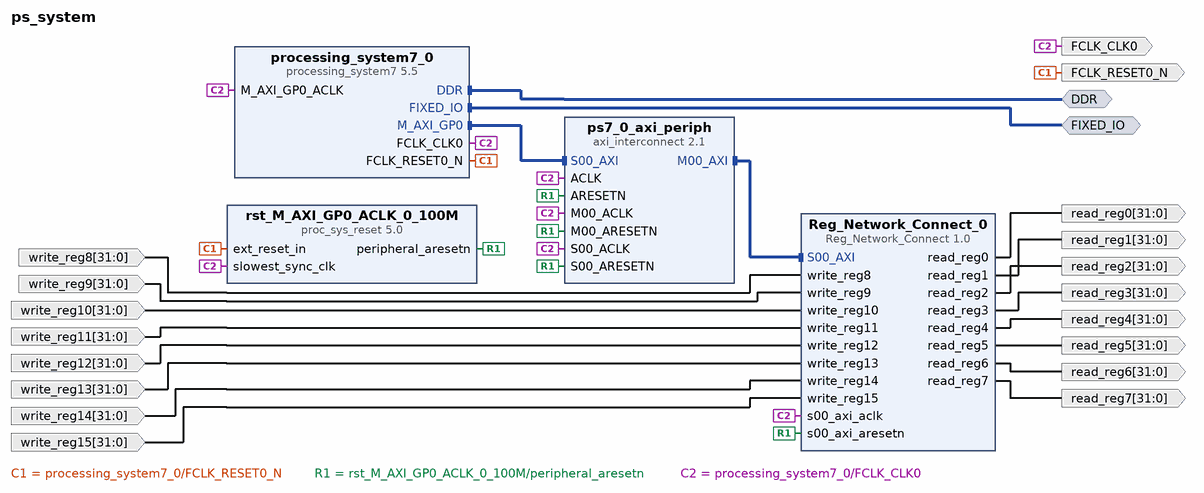
[diagram p0: block diagram of the top level]
# Vivado block design ps_system, xc7z010clg400-1, Vivado 2020.1
create_bd_design ps_system

create_bd_intf_port -mode Master -vlnv xilinx.com:interface:ddrx_rtl:1.0 DDR
create_bd_intf_port -mode Master -vlnv xilinx.com:display_processing_system7:fixedio_rtl:1.0 FIXED_IO
create_bd_port -dir O -from 31 -to 0 read_reg0
create_bd_port -dir O -from 31 -to 0 read_reg1
create_bd_port -dir O -from 31 -to 0 read_reg2
create_bd_port -dir O -from 31 -to 0 read_reg3
create_bd_port -dir O -from 31 -to 0 read_reg6
create_bd_port -dir O -from 31 -to 0 read_reg4
create_bd_port -dir O -from 31 -to 0 read_reg5
create_bd_port -dir O -from 31 -to 0 read_reg7
create_bd_port -dir I -from 31 -to 0 write_reg14
create_bd_port -dir I -from 31 -to 0 write_reg12
create_bd_port -dir I -from 31 -to 0 write_reg8
create_bd_port -dir I -from 31 -to 0 write_reg9
create_bd_port -dir I -from 31 -to 0 write_reg13
create_bd_port -dir I -from 31 -to 0 write_reg10
create_bd_port -dir I -from 31 -to 0 write_reg11
create_bd_port -dir I -from 31 -to 0 write_reg15
create_bd_port -dir O -type rst FCLK_RESET0_N
create_bd_port -dir O -type clk FCLK_CLK0
set_property -dict {CONFIG.ASSOCIATED_RESET FCLK_RESET0_N_0} [get_bd_ports FCLK_CLK0]

create_bd_cell -type ip -vlnv xilinx.com:ip:processing_system7:5.5 processing_system7_0
set_property -dict {CONFIG.PCW_FPGA0_PERIPHERAL_FREQMHZ 125} [get_bd_cells processing_system7_0]
# 30 more settings of processing_system7_0 are not shown: defaults, MIO pin electricals, DDR timing, and values the tool derives
create_bd_cell -type ip -vlnv xilinx.com:ip:axi_interconnect:2.1 ps7_0_axi_periph
set_property -dict {CONFIG.NUM_MI 1} [get_bd_cells ps7_0_axi_periph]
create_bd_cell -type ip -vlnv xilinx.com:ip:proc_sys_reset:5.0 rst_M_AXI_GP0_ACLK_0_100M
create_bd_cell -type ip -vlnv xilinx.com:user:Reg_Network_Connect:1.0 Reg_Network_Connect_0

# ---- connections ----

connect_bd_intf_net [get_bd_intf_ports DDR] [get_bd_intf_pins processing_system7_0/DDR]
connect_bd_intf_net [get_bd_intf_pins processing_system7_0/M_AXI_GP0] [get_bd_intf_pins ps7_0_axi_periph/S00_AXI]
connect_bd_intf_net [get_bd_intf_ports FIXED_IO] [get_bd_intf_pins processing_system7_0/FIXED_IO]
connect_bd_intf_net [get_bd_intf_pins ps7_0_axi_periph/M00_AXI] [get_bd_intf_pins Reg_Network_Connect_0/S00_AXI]
connect_bd_net [get_bd_pins processing_system7_0/FCLK_RESET0_N] [get_bd_ports FCLK_RESET0_N] [get_bd_pins rst_M_AXI_GP0_ACLK_0_100M/ext_reset_in]
connect_bd_net [get_bd_pins rst_M_AXI_GP0_ACLK_0_100M/peripheral_aresetn] \
  [get_bd_pins ps7_0_axi_periph/S00_ARESETN] [get_bd_pins ps7_0_axi_periph/M00_ARESETN] \
  [get_bd_pins ps7_0_axi_periph/ARESETN] [get_bd_pins Reg_Network_Connect_0/s00_axi_aresetn]
connect_bd_net [get_bd_pins processing_system7_0/FCLK_CLK0] \
  [get_bd_pins processing_system7_0/M_AXI_GP0_ACLK] [get_bd_pins ps7_0_axi_periph/S00_ACLK] \
  [get_bd_pins rst_M_AXI_GP0_ACLK_0_100M/slowest_sync_clk] [get_bd_pins ps7_0_axi_periph/M00_ACLK] \
  [get_bd_pins ps7_0_axi_periph/ACLK] [get_bd_ports FCLK_CLK0] [get_bd_pins Reg_Network_Connect_0/s00_axi_aclk]
connect_bd_net -net write_reg8_1 [get_bd_ports write_reg8] [get_bd_pins Reg_Network_Connect_0/write_reg8]
connect_bd_net -net write_reg9_1 [get_bd_ports write_reg9] [get_bd_pins Reg_Network_Connect_0/write_reg9]
connect_bd_net -net write_reg10_1 [get_bd_ports write_reg10] [get_bd_pins Reg_Network_Connect_0/write_reg10]
connect_bd_net -net write_reg11_1 [get_bd_ports write_reg11] [get_bd_pins Reg_Network_Connect_0/write_reg11]
connect_bd_net -net write_reg12_1 [get_bd_ports write_reg12] [get_bd_pins Reg_Network_Connect_0/write_reg12]
connect_bd_net -net write_reg13_1 [get_bd_ports write_reg13] [get_bd_pins Reg_Network_Connect_0/write_reg13]
connect_bd_net -net write_reg14_1 [get_bd_ports write_reg14] [get_bd_pins Reg_Network_Connect_0/write_reg14]
connect_bd_net -net write_reg15_1 [get_bd_ports write_reg15] [get_bd_pins Reg_Network_Connect_0/write_reg15]
connect_bd_net [get_bd_pins Reg_Network_Connect_0/read_reg0] [get_bd_ports read_reg0]
connect_bd_net [get_bd_pins Reg_Network_Connect_0/read_reg1] [get_bd_ports read_reg1]
connect_bd_net [get_bd_pins Reg_Network_Connect_0/read_reg2] [get_bd_ports read_reg2]
connect_bd_net [get_bd_pins Reg_Network_Connect_0/read_reg4] [get_bd_ports read_reg4]
connect_bd_net [get_bd_pins Reg_Network_Connect_0/read_reg3] [get_bd_ports read_reg3]
connect_bd_net [get_bd_pins Reg_Network_Connect_0/read_reg5] [get_bd_ports read_reg5]
connect_bd_net [get_bd_pins Reg_Network_Connect_0/read_reg6] [get_bd_ports read_reg6]
connect_bd_net [get_bd_pins Reg_Network_Connect_0/read_reg7] [get_bd_ports read_reg7]

# ---- address map ----
assign_bd_address -offset 0x43C00000 -range 64K -target_address_space [get_bd_addr_spaces processing_system7_0/Data] [get_bd_addr_segs Reg_Network_Connect_0/S00_AXI/S00_AXI_reg]

validate_bd_design
save_bd_design
